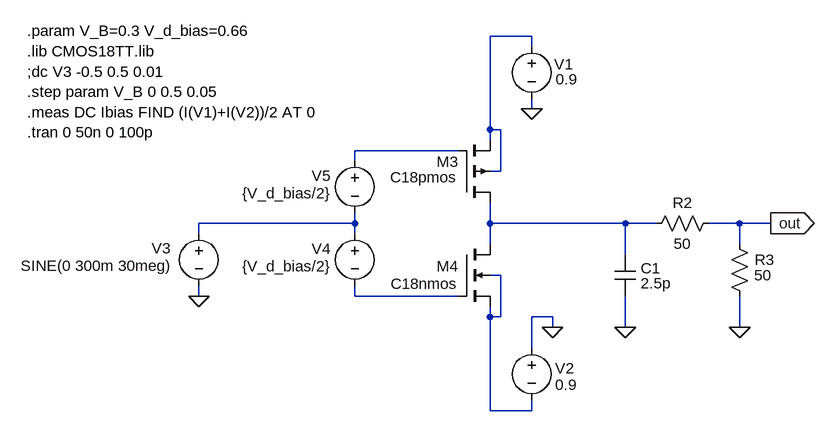
[diagram p0: schematic Drive.asc]
Drive.asc, the LTspice schematic file:
Version 4
SHEET 1 1044 680
WIRE 256 -1280 192 -1280
WIRE 256 -1264 256 -1280
WIRE 256 -1168 256 -1184
WIRE 192 -1136 192 -1280
WIRE 208 -1136 192 -1136
WIRE 192 -1120 192 -1136
WIRE 144 -1104 -16 -1104
WIRE -16 -1088 -16 -1104
WIRE 208 -1072 208 -1136
WIRE 208 -1072 192 -1072
WIRE -16 -992 -16 -1008
WIRE -16 -992 -256 -992
WIRE 192 -992 192 -1024
WIRE 400 -992 192 -992
WIRE 448 -992 400 -992
WIRE 576 -992 528 -992
WIRE 624 -992 576 -992
WIRE -256 -976 -256 -992
WIRE -16 -976 -16 -992
WIRE 192 -960 192 -992
WIRE 576 -960 576 -992
WIRE 400 -944 400 -992
WIRE 208 -912 192 -912
WIRE -256 -880 -256 -896
WIRE -16 -880 -16 -896
WIRE 144 -880 -16 -880
WIRE 192 -848 192 -864
WIRE 208 -848 208 -912
WIRE 208 -848 192 -848
WIRE 288 -848 256 -848
WIRE 288 -832 288 -848
WIRE 400 -832 400 -880
WIRE 576 -832 576 -880
WIRE 256 -800 256 -848
WIRE 192 -704 192 -848
WIRE 256 -704 256 -720
WIRE 256 -704 192 -704
FLAG 576 -832 0
FLAG -256 -880 0
FLAG 400 -832 0
FLAG 256 -1168 0
FLAG 288 -832 0
FLAG 624 -992 out
IOPIN 624 -992 Out
SYMBOL pmos4 144 -1024 M180
WINDOW 0 0 63 Right 2
WINDOW 3 -2 39 Right 2
SYMATTR InstName M3
SYMATTR Value C18pmos
SYMATTR Value2 l=180n w=40u m=11
SYMBOL nmos4 144 -960 R0
WINDOW 0 0 34 Right 2
WINDOW 3 -1 61 Right 2
SYMATTR InstName M4
SYMATTR Value C18nmos
SYMATTR Value2 l=180n w=40u m=3
SYMBOL voltage 256 -1280 R0
WINDOW 123 0 0 Left 2
WINDOW 39 0 0 Left 2
WINDOW 0 35 43 Left 2
WINDOW 3 37 66 Left 2
SYMATTR InstName V1
SYMATTR Value 0.9
SYMBOL voltage 256 -816 R0
WINDOW 123 0 0 Left 2
WINDOW 39 0 0 Left 2
WINDOW 0 36 47 Left 2
WINDOW 3 36 72 Left 2
SYMATTR InstName V2
SYMATTR Value 0.9
SYMBOL res 544 -1008 R90
WINDOW 0 0 56 VBottom 2
WINDOW 3 32 56 VTop 2
SYMATTR InstName R2
SYMATTR Value 50
SYMBOL res 592 -864 R180
WINDOW 0 -7 72 Right 2
WINDOW 3 -6 48 Right 2
SYMATTR InstName R3
SYMATTR Value 50
SYMBOL voltage -16 -992 R0
WINDOW 123 0 0 Left 2
WINDOW 39 0 0 Left 2
WINDOW 0 -37 39 Right 2
WINDOW 3 -36 66 Right 2
SYMATTR InstName V4
SYMATTR Value {V_d_bias/2}
SYMBOL voltage -256 -992 M0
WINDOW 123 0 0 Left 0
WINDOW 39 0 0 Left 0
WINDOW 3 40 65 Left 2
WINDOW 0 43 38 Left 2
SYMATTR Value SINE(0 300m 30meg)
SYMATTR InstName V3
SYMBOL cap 384 -944 R0
WINDOW 0 40 21 Left 2
WINDOW 3 40 44 Left 2
SYMATTR InstName C1
SYMATTR Value 2.5p
SYMBOL voltage -16 -1104 R0
WINDOW 123 0 0 Left 2
WINDOW 39 0 0 Left 2
WINDOW 0 -37 39 Right 2
WINDOW 3 -36 66 Right 2
SYMATTR InstName V5
SYMATTR Value {V_d_bias/2}
TEXT -520 -1288 Left 2 !.param V_B=0.3 V_d_bias=0.66\n.lib CMOS18TT.lib\n;dc V3 -0.5 0.5 0.01\n.step param V_B 0 0.5 0.05\n.meas DC Ibias FIND (I(V1)+I(V2))/2 AT 0\n.tran 0 50n 0 100p

The netlist it stands for:
* Drive.asc
M3 N004 N002 N001 N001 C18pmos l=180n w=40u m=11
M4 N004 N006 N005 N005 C18nmos l=180n w=40u m=3
V1 N001 0 0.9
V2 0 N005 0.9
R2 out N004 50
R3 0 out 50
V4 N003 N006 {V_d_bias/2}
V3 N003 0 SINE(0 300m 30meg)
C1 N004 0 2.5p
V5 N002 N003 {V_d_bias/2}
.model NMOS NMOS
.model PMOS PMOS
.lib standard.mos
.param V_B=0.3 V_d_bias=0.66
.lib CMOS18TT.lib
;dc V3 -0.5 0.5 0.01
.step param V_B 0 0.5 0.05
.meas DC Ibias FIND (I(V1)+I(V2))/2 AT 0
.tran 0 50n 0 100p
.backanno
.end